# Altium schematic sheet ET2_test_Chip.SchDoc: ET2_test Chip
size A4; Author: Wei Zhang
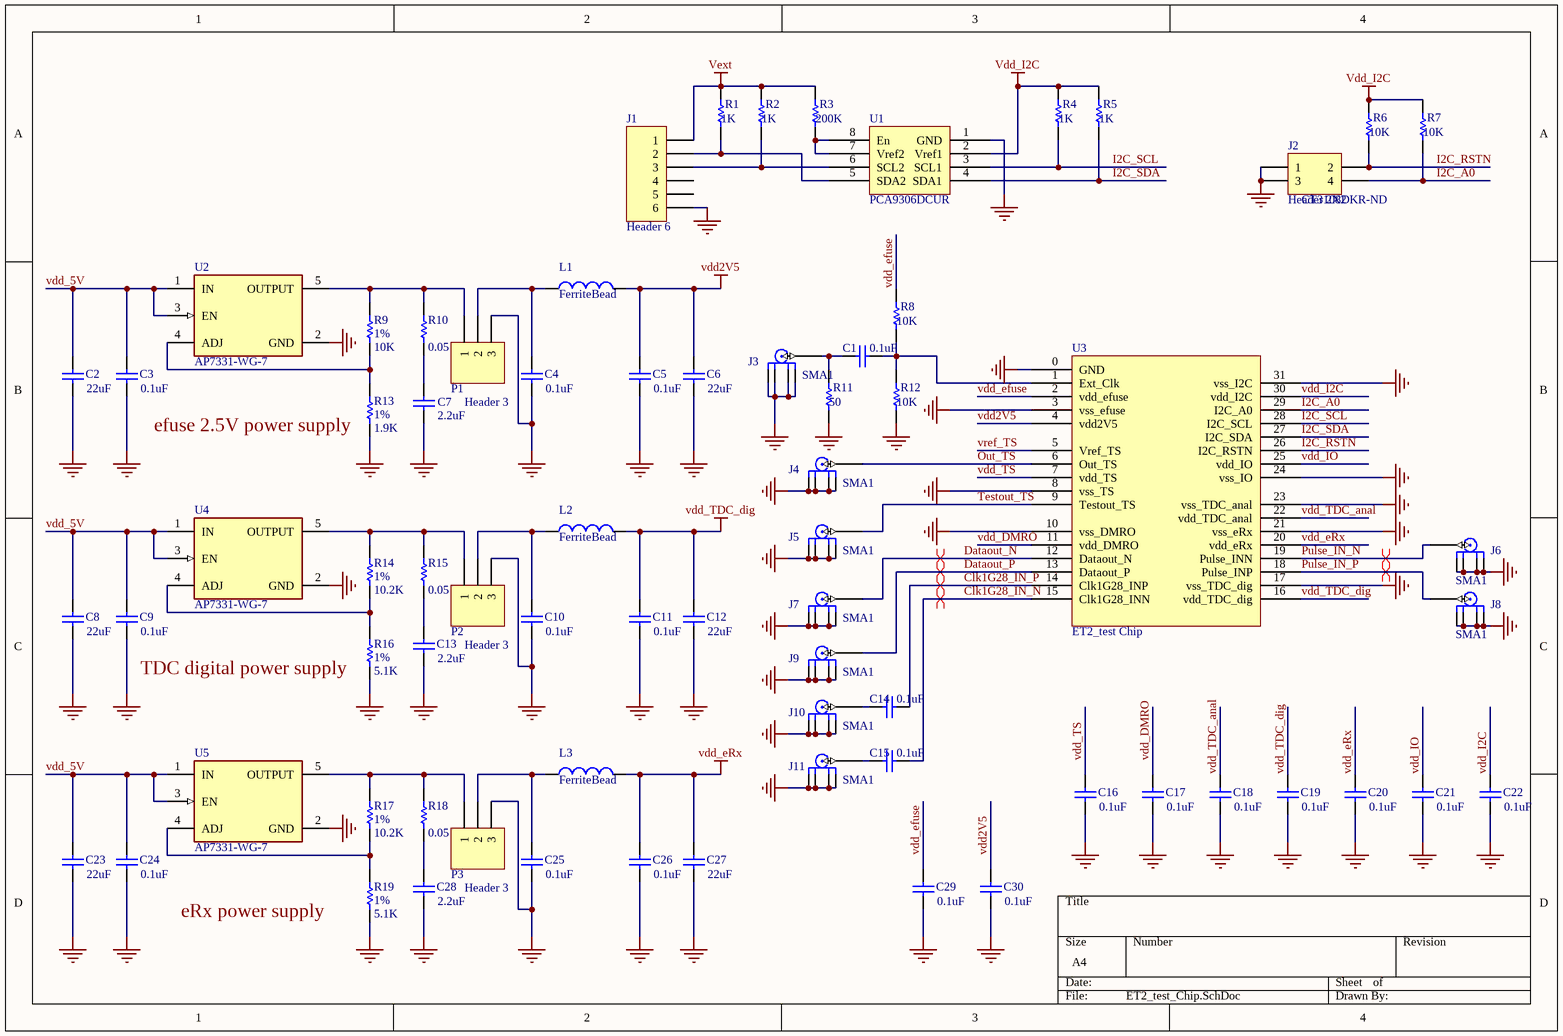
[diagram p0: ET2_test_Chip.SchDoc]

## Parts
C1  value 0.1uF  [0402-eagle]  (hidden comment: Cap)
C2  value 22uF  [C1210]  (hidden comment: Cap)
C3  value 0.1uF  [0805-eagle]  (hidden comment: Cap)
C4  value 0.1uF  [0805-eagle]  (hidden comment: Cap)
C5  value 0.1uF  [0805-eagle]  (hidden comment: Cap)
C6  value 22uF  [C1210]  (hidden comment: Cap)
C7  value 2.2uF  [0805-eagle]  (hidden comment: Cap)
C8  value 22uF  [C1210]  (hidden comment: Cap)
C9  value 0.1uF  [0805-eagle]  (hidden comment: Cap)
C10  value 0.1uF  [0805-eagle]  (hidden comment: Cap)
C11  value 0.1uF  [0805-eagle]  (hidden comment: Cap)
C12  value 22uF  [C1210]  (hidden comment: Cap)
C13  value 2.2uF  [0805-eagle]  (hidden comment: Cap)
C14  value 0.1uF  [0402-eagle]  (hidden comment: Cap)
C15  value 0.1uF  [0402-eagle]  (hidden comment: Cap)
C16  value 0.1uF  [0402-eagle]  (hidden comment: Cap)
C17  value 0.1uF  [0402-eagle]  (hidden comment: Cap)
C18  value 0.1uF  [0402-eagle]  (hidden comment: Cap)
C19  value 0.1uF  [0402-eagle]  (hidden comment: Cap)
C20  value 0.1uF  [0402-eagle]  (hidden comment: Cap)
C21  value 0.1uF  [0402-eagle]  (hidden comment: Cap)
C22  value 0.1uF  [0402-eagle]  (hidden comment: Cap)
C23  value 22uF  [C1210]  (hidden comment: Cap)
C24  value 0.1uF  [0805-eagle]  (hidden comment: Cap)
C25  value 0.1uF  [0805-eagle]  (hidden comment: Cap)
C26  value 0.1uF  [0805-eagle]  (hidden comment: Cap)
C27  value 22uF  [C1210]  (hidden comment: Cap)
C28  value 2.2uF  [0805-eagle]  (hidden comment: Cap)
C29  value 0.1uF  [0402-eagle]  (hidden comment: Cap)
C30  value 0.1uF  [0402-eagle]  (hidden comment: Cap)
J1  Header 6  [USB_ISS]
J2  Header 2X2  [HDR2X2]
J3  SMA1  [SMA_MID]
J4  SMA1  [SMA_MID]
J5  SMA1  [SMA_MID]
J6  SMA1  [SMA_MID]
J7  SMA1  [SMA_MID]
J8  SMA1  [SMA_MID]
J9  SMA1  [SMA_MID]
J10  SMA1  [SMA_MID]
J11  SMA1  [SMA_MID]
L1  value FerriteBead  [0805-eagle]  (hidden comment: Inductor)
L2  value FerriteBead  [0805-eagle]  (hidden comment: Inductor)
L3  value FerriteBead  [0805-eagle]  (hidden comment: Inductor)
P1  Header 3  [Header3_L]
P2  Header 3  [Header3_L]
P3  Header 3  [Header3_L]
R1  value 1K  [0402-eagle]  (hidden comment: Res1)
R2  value 1K  [0402-eagle]  (hidden comment: Res1)
R3  value 200K  [0402-eagle]  (hidden comment: Res1)
R4  value 1K  [0402-eagle]  (hidden comment: Res1)
R5  value 1K  [0402-eagle]  (hidden comment: Res1)
R6  value 10K  [0402-eagle]  (hidden comment: Res1)
R7  value 10K  [0402-eagle]  (hidden comment: Res1)
R8  value 10K  [0402-eagle]  (hidden comment: Res1)
R9  1%  value 10K  [0402-eagle]
R10  value 0.05  [0402-eagle]  (hidden comment: 1%)
R11  value 50  [0402-eagle]  (hidden comment: Res1)
R12  value 10K  [0402-eagle]  (hidden comment: Res1)
R13  1%  value 1.9K  [0402-eagle]
R14  1%  value 10.2K  [0402-eagle]
R15  value 0.05  [0402-eagle]  (hidden comment: 1%)
R16  1%  value 5.1K  [0402-eagle]
R17  1%  value 10.2K  [0402-eagle]
R18  value 0.05  [0402-eagle]  (hidden comment: 1%)
R19  1%  value 5.1K  [0402-eagle]
U1  PCA9306DCUR  [PCA9306]
U2  AP7331-WG-7  [FP-SOT25-MFG]
U3  ET2_test Chip
U4  AP7331-WG-7  [FP-SOT25-MFG]
U5  AP7331-WG-7  [FP-SOT25-MFG]

## Nets
GND: C2.1 C3.1 C4.1 C5.1 C6.1 C7.1 C8.1 C9.1 C10.1 C11.1 C12.1 C13.1 C16.1 C17.1 C18.1 C19.1 C20.1 C21.1 C22.1 C23.1 C24.1 C25.1 C26.1 C27.1 C28.1 C29.1 C30.1 J1.6 J2.1 J2.3 J3.2 J3.3 J3.4 J3.5 J4.2 J4.3 J4.4 J4.5 J5.2 J5.3 J5.4 J5.5 J6.2 J6.3 J6.4 J6.5 J7.2 J7.3 J7.4 J7.5 J8.2 J8.3 J8.4 J8.5 J9.2 J9.3 J9.4 J9.5 J10.2 J10.3 J10.4 J10.5 J11.2 J11.3 J11.4 J11.5 P1.3 P2.3 P3.3 R11.1 R12.1 R13.1 R16.1 R19.1 U1.1(GND) U2.2(GND) U3.0(GND) U3.3(vss_efuse) U3.8(vss_TS) U3.10(vss_DMRO) U3.17(vss_TDC_dig) U3.21(vss_eRx) U3.23(vss_TDC_anal) U3.24(vss_IO) U3.31(vss_I2C) U4.2(GND) U5.2(GND)
vdd2V5: C5.2 C6.2 C30.2 L1.2 U3.4(vdd2V5)
vdd_eRx: C20.2 C26.2 C27.2 L3.2 U3.20(vdd_eRx)
vdd_I2C: C22.2 R4.2 R5.2 R6.2 R7.2 U1.2(Vref1) U3.30(vdd_I2C)
vdd_TDC_dig: C11.2 C12.2 C19.2 L2.2 U3.16(vdd_TDC_dig)
Vext: J1.1 R1.2 R2.2 R3.2
Clk1G28_IN_N: C15.2 U3.15(Clk1G28_INN)
Clk1G28_IN_P: C14.2 U3.14(Clk1G28_INP)
Dataout_N: J7.1 U3.12(Dataout_N)
Dataout_P: J9.1 U3.13(Dataout_P)
I2C_A0: J2.4 R7.1 U3.29(I2C_A0)
I2C_RSTN: J2.2 R6.1 U3.26(I2C_RSTN)
I2C_SCL: R4.1 U1.3(SCL1) U3.28(I2C_SCL)
I2C_SDA: R5.1 U1.4(SDA1) U3.27(I2C_SDA)
Out_TS: J4.1 U3.6(Out_TS)
Pulse_IN_N: J6.1 U3.19(Pulse_INN)
Pulse_IN_P: J8.1 U3.18(Pulse_INP)
Testout_TS: J5.1 U3.9(Testout_TS)
vdd_5V: C2.2 C3.2 C8.2 C9.2 C23.2 C24.2 U2.1(IN) U2.3(EN) U4.1(IN) U4.3(EN) U5.1(IN) U5.3(EN)
vdd_DMRO: C17.2 U3.11(vdd_DMRO)
vdd_efuse: C29.2 R8.2 U3.2(vdd_efuse)
vdd_IO: C21.2 U3.25(vdd_IO)
vdd_TDC_anal: C18.2 U3.22(vdd_TDC_anal)
vdd_TS: C16.2 U3.7(vdd_TS)
vref_TS: U3.5(Vref_TS)
NetC1_1: C1.1 J3.1 R11.2
NetC1_2: C1.2 R8.1 R12.2 U3.1(Ext_Clk)
NetC4_2: C4.2 L1.1 P1.2
NetC7_2: C7.2 R10.1
NetC10_2: C10.2 L2.1 P2.2
NetC13_2: C13.2 R15.1
NetC14_1: C14.1 J10.1
NetC15_1: C15.1 J11.1
NetC25_2: C25.2 L3.1 P3.2
NetC28_2: C28.2 R18.1
NetJ1_2: J1.2 R1.1 U1.5(SDA2)
NetJ1_3: J1.3 R2.1 U1.6(SCL2)
NetP1_1: P1.1 R9.2 R10.2 U2.5(OUTPUT)
NetP2_1: P2.1 R14.2 R15.2 U4.5(OUTPUT)
NetP3_1: P3.1 R17.2 R18.2 U5.5(OUTPUT)
NetR3_1: R3.1 U1.7(Vref2) U1.8(En)
NetR9_1: R9.1 R13.2 U2.4(ADJ)
NetR14_1: R14.1 R16.2 U4.4(ADJ)
NetR17_1: R17.1 R19.2 U5.4(ADJ)

Not connected (* = marked no-connect by the designer): J1 4 5

## Layout directives
differential pair: Clk1G28_IN_N, Clk1G28_IN_P, Dataout_N, Dataout_P, Pulse_IN_N, Pulse_IN_P

## Notes on the sheet
- (near J2) CT3108DKR-ND
- (near R13) efuse 2.5V power supply
- (near R16) TDC digital power supply
- (near R19) eRx power supply

## Library data of the parts
C1-C30 = Cap: Capacitor; Published: 8-Jun-2000; LatestRevisionDate: 17-Jul-2002; LatestRevisionNote: Re-released for DXP Platform.; PackageReference: RAD-0.3; Publisher: Altium Limited; PackageDescription: Radial Cap, Thru-Hole; 2 Leads; 0.3 in Pin Spacing
J1 = Header 6: Header, 6-Pin; LatestRevisionDate: 17-Jul-2002; LatestRevisionNote: Re-released for DXP Platform.; Publisher: Altium Limited
J2 = Header 2X2: Header, 2-Pin, Dual row; LatestRevisionDate: 17-Jul-2002; LatestRevisionNote: Re-released for DXP Platform.; Publisher: Altium Limited
L1-L3 = Inductor: Code_IEC: 1005; Published: 8-Jun-2000; LatestRevisionDate: 29-May-2009; LatestRevisionNote: IPC-7351 Footprint Added.; PackageReference: 0402-A; Publisher: Altium Limited; PackageDescription: Chip Inductor; Code_JEITA: 0402
P1-P3 = Header 3: Header, 3-Pin; LatestRevisionDate: 17-Jul-2002; LatestRevisionNote: Re-released for DXP Platform.; Publisher: Altium Limited
R1-R19 = Res1: Resistor; Published: 8-Jun-2000; LatestRevisionDate: 17-Jul-2002; LatestRevisionNote: Re-released for DXP Platform.; PackageReference: AXIAL-0.3; Publisher: Altium Limited; PackageDescription: Axial Device, Thru-Hole; 2 Leads; 0.3 in Pin Spacing
U1 = PCA9306
U2 U4 U5 = CMP-12756-000022-1: IC REG LIN POS ADJ 300MA SOT25; Manufacturer: Diodes Inc.; Dropout Voltage: 300mV; Nominal Supply Current: 55-65uA; Standoff Height: 0.013mm; Output Voltage: 0.8-5V; Min Supply Voltage: 2V; Number Of Outputs: 1; Max Supply Voltage: 6V; Output Type: AdjustableProgrammable; Accuracy Percentage: 2%; Max Junction Temp: +150°C; Max Power Dissipation: 640mW; RoHS: TRUE; ComponentLink2URL: https://www.diodes.com/assets/Datasheets/AP7331.pdf; Package: SOT25; Category: IC; Temperature Range Low: -40°C; ComponentLink2Description: Datasheet; Automotive: No; Device Class L3: Voltage Regulators - Linear; Mouser Description: AP7331 Series 0.8 - 5 V ADJ Output 300 mA LDO Linear Regulator - SOT-25; Device Class L2: Power Management ICs; Temperature Range High: +125°C; Lead Free: Yes; Footprint Url: https://www.diodes.com/assets/Package-Files/SOT25.pdf; Manufacturer Part Number: AP7331-WG-7; Device Class L1: Integrated Circuits (ICs); Octopart: https://octopart.com/ap7331-wg-7-diodes+inc.-17930424; Ambient Temperature Range Low: -40°C; Output Current: 300mA; Height: 1.4mm; Ambient Temperature Range High: +85°C; Temperature: -40°C to +125°C; Digikey Description: IC REG LIN POS ADJ 300MA SOT25